# Altium schematic sheet tl494_ctrl.SchDoc
size A4; SheetNumber: 11; SheetTotal: 14
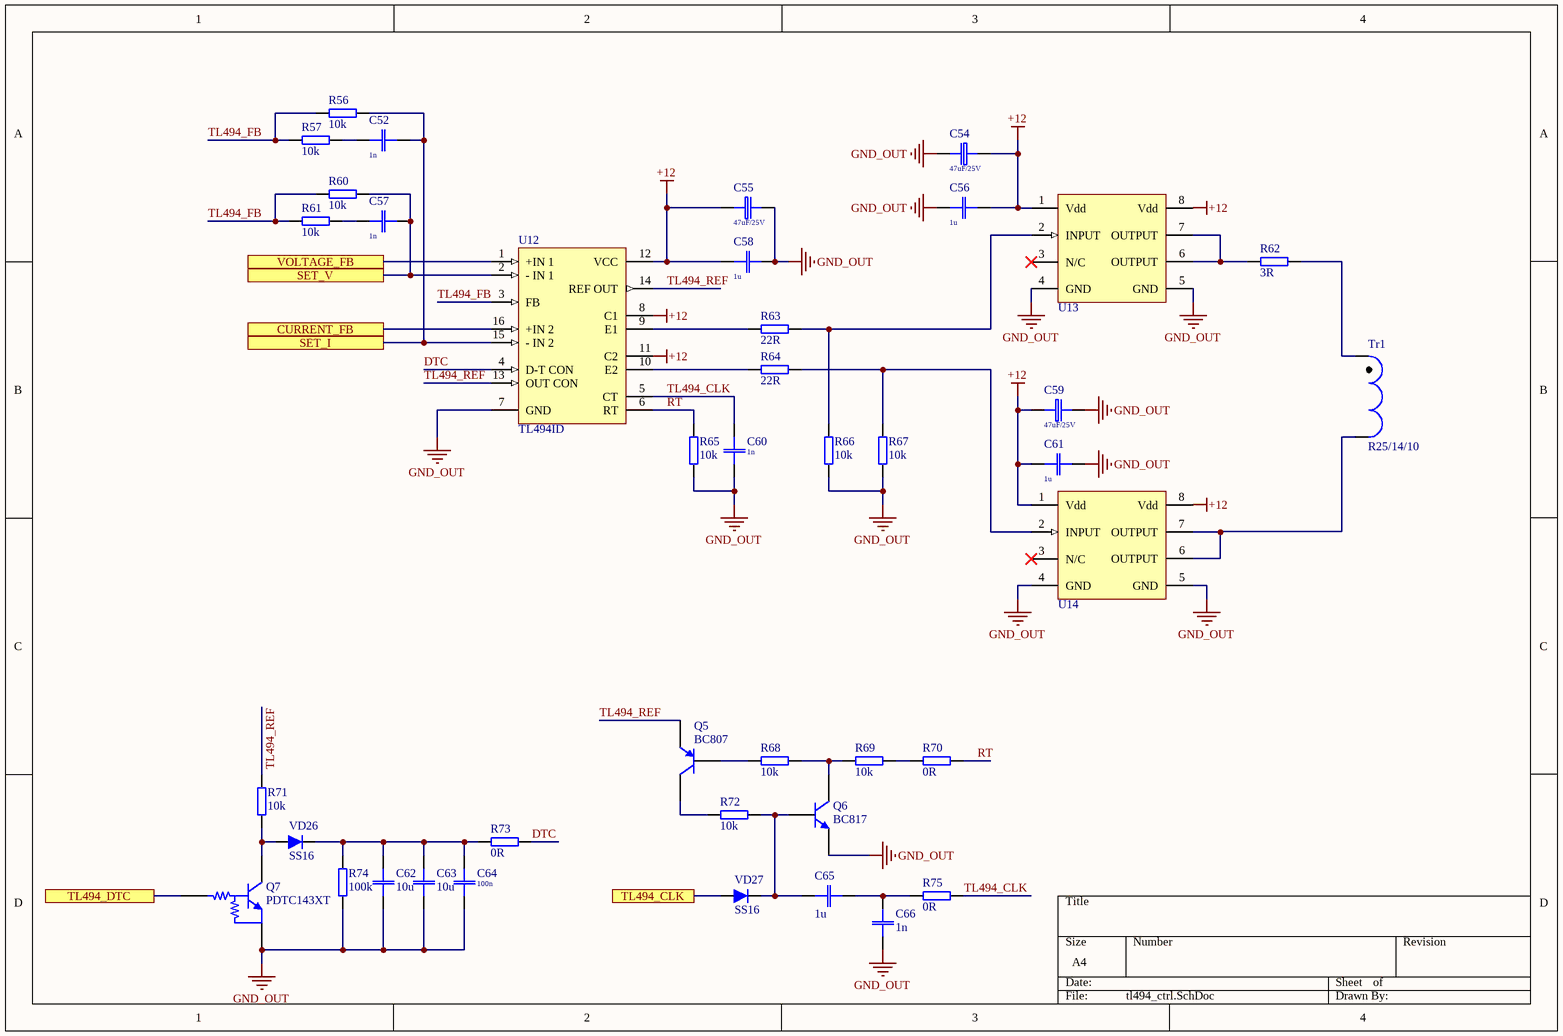
[diagram p0: tl494_ctrl.SchDoc]

## Parts
C52  1n  [C0603]
C54  47uF/25V  [EL Case C (6032-28)]
C55  47uF/25V  [EL Case C (6032-28)]
C56  1u  [C1206(3216)]
C57  1n  [C0603]
C58  1u  [C1206(3216)]
C59  47uF/25V  [EL Case C (6032-28)]
C60  1n  [C0603]
C61  1u  [C1206(3216)]
C62  10u  [CAP: 0805]
C63  10u  [CAP: 0805]
C64  100n  [C0603]
C65  1u  [CAP: 0805]
C66  1n  [CAP: 0805]
Q5  BC807  [SOT23_N]
Q6  BC817  [SOT23_N]
Q7  PDTC143XT  [SOT23_N]
R56  10k  [RES: 0603]
R57  10k  [RES: 0603]
R60  10k  [RES: 0603]
R61  10k  [RES: 0603]
R62  3R  [RES: 1206]
R63  22R  [RES: 0603]
R64  22R  [RES: 0603]
R65  10k  [RES: 0603]
R66  10k  [RES: 0603]
R67  10k  [RES: 0603]
R68  10k  [RES: 0603]
R69  10k  [RES: 0603]
R70  0R  [RES: 0603]
R71  10k  [RES: 0603]
R72  10k  [RES: 0603]
R73  0R  [RES: 0603]
R74  100k  [RES: 0603]
R75  0R  [RES: 0603]
Tr1  R25/14/10  [IND: PRIMARY_SIDE_HB_B]
U12  TL494ID  [D016_N]
U13  TC4420  [8-SOIC]  (value not drawn)
U14  TC4420  [8-SOIC]  (value not drawn)
VD26  SS16  [DIODE: SOD123]
VD27  SS16  [DIODE: SOD123]

## Ports
CURRENT_FB, SET_I, SET_V, TL494_CLK, TL494_DTC, VOLTAGE_FB

## Nets
+12: C54.1(+) C55.1(+) C56.1 C58.1 C59.1(+) C61.1 U12.8(C1) U12.11(C2) U12.12(VCC) U13.1(Vdd) U13.8(Vdd) U14.1(Vdd) U14.8(Vdd)
GND_OUT: C54.2(-) C55.2(-) C56.2 C58.2 C59.2(-) C60.1 C61.2 C62.1 C63.1 C64.1 C66.2 Q6.2(E) Q7.2(E) R65.2 R66.2 R67.2 R74.1 U12.7(GND) U13.4(GND) U13.5(GND) U14.4(GND) U14.5(GND)
CURRENT_FB: U12.16(+IN_2) ; port CURRENT_FB
DTC: R73.1 U12.4(D-T_CON)
RT: R65.1 R70.2 U12.6(RT)
SET_I: C52.1 R56.2 U12.15(-_IN_2) ; port SET_I
SET_V: C57.1 R60.2 U12.2(-_IN_1) ; port SET_V
TL494_CLK: C60.2 R75.2 U12.5(CT)
TL494_CLK: VD27.1(A) ; port TL494_CLK  [a separate net that carries the same name]
TL494_DTC: Q7.1(B) ; port TL494_DTC
TL494_FB: R56.1 R57.1 R60.1 R61.1 U12.3(FB)
TL494_REF: Q5.2(E) R71.1 U12.13(OUT_CON) U12.14(REF_OUT)
VOLTAGE_FB: U12.1(+IN_1) ; port VOLTAGE_FB
NetC52_2: C52.2 R57.2
NetC57_2: C57.2 R61.2
NetC62_2: C62.2 C63.2 C64.2 R73.2 R74.2 VD26.2(C)
NetC65_1: C65.1 C66.1 R75.1
NetC65_2: C65.2 Q6.1(B) R72.2 VD27.2(C)
NetQ5_1: Q5.1(B) R68.1
NetQ5_3: Q5.3(C) R72.1
NetQ6_3: Q6.3(C) R68.2 R69.1
NetQ7_3: Q7.3(C) R71.2 VD26.1(A)
NetR62_1: R62.1 U13.6(OUTPUT) U13.7(OUTPUT)
NetR62_2: R62.2 Tr1.1
NetR63_1: R63.1 U12.9(E1)
NetR63_2: R63.2 R66.1 U13.2(INPUT)
NetR64_1: R64.1 U12.10(E2)
NetR64_2: R64.2 R67.1 U14.2(INPUT)
NetR69_2: R69.2 R70.1
NetTr1_2: Tr1.2 U14.6(OUTPUT) U14.7(OUTPUT)

Not connected (* = marked no-connect by the designer): U13 3(N/C)*; U14 3(N/C)*

## Library data of the parts
C52 C57 C60 C64 = C-0603: SMD-0603; Price: 0.014
  C52 C57 C60: Value: 1n
  C64: Value: 100n
C54 C55 C59 = EL Case C (6032-28): EL Tantalum Case C (6032-28); Price: 0.41; Value: 47uF/25V
C56 C58 C61 = C-1206  100V 1u: SMD-1206 100V X7R 10%; Price: 0.085; Value: 1u
C62 C63 C65 C66 = C_SMD
  C62 C63: Value: 10u
  C65: Value: 1u
  C66: Value: 1n
Q5 = BC807: PNP General-purpose Transistor; Published: 17-Sep-2003; LatestRevisionDate: 12-Dec-2006; LatestRevisionNote: IPC-7351 Footprint Added.; DatasheetVersion: 8-Apr-1999; PackageVersion: May-1999; PackageReference: SOT23; Publisher: Altium Limited; PackageDescription: 3-Pin SOT-23 Package 0.95 mm Pitch, 2.3 mm Lead Span; ComponentLink1Description: Manufacturer Link; ComponentLink1URL: http://www.semiconductors.philips.com/; ComponentLink2Description: Datasheet; ComponentLink2URL: http://www.semiconductors.philips.com/acrobat/datasheets/BC807_BC807W_BC327_5.pdf
Q6 = BC817: NPN General-purpose Transistor; Published: 17-Sep-2003; LatestRevisionDate: 12-Dec-2006; LatestRevisionNote: IPC-7351 Footprint Added.; DatasheetVersion: Jun-1999; PackageVersion: May-1999; PackageReference: SOT23; Publisher: Altium Limited; PackageDescription: 3-Pin SOT-23 Package 0.95 mm Pitch, 2.3 mm Lead Span; ComponentLink1Description: Manufacturer Link; ComponentLink1URL: http://www.semiconductors.philips.com/; ComponentLink2Description: Datasheet; ComponentLink2URL: http://www.semiconductors.philips.com/acrobat/datasheets/BC817_BC817W_BC337_5.pdf
Q7 = PDTC143XT: NPN Resistor-equipped Transistor; Published: 17-Sep-2003; LatestRevisionDate: 12-Dec-2006; LatestRevisionNote: IPC-7351 Footprint Added.; DatasheetVersion: 20-Apr-1999; PackageVersion: May-1999; PackageReference: SOT23; Publisher: Altium Limited; PackageDescription: 3-Pin SOT-23 Package 0.95 mm Pitch, 2.3 mm Lead Span; ComponentLink1Description: Manufacturer Link; ComponentLink1URL: http://www.semiconductors.philips.com/; ComponentLink2Description: Datasheet; ComponentLink2URL: http://www.semiconductors.philips.com/acrobat/datasheets/PDTC143X_SERIES_8.pdf
R56 R57 R60-R75 = R_SMD
  R56 R57 R60 R61 R65-R69 R71 R72: Value: 10k
  R62: Value: 3R
  R63 R64: Value: 22R
  R70 R73 R75: Value: 0R
  R74: Value: 100k
Tr1 = Primary: Value: R25/14/10
U12 = TL494ID: Pulse-Width-Modulation Control Circuit; Published: 15-Apr-2002; LatestRevisionDate: 13-Apr-2006; LatestRevisionNote: IPC-7351 Footprint Added.; DatasheetVersion: Oct-1988; PackageVersion: Jan-1998; PackageReference: D016; Publisher: Altium Limited; PackageDescription: 16-Pin Small Outline Integrated Circuit 1.27 mm Pitch; Code_IPC: SOIC127P600-16; ComponentLink1Description: Manufacturer Link; ComponentLink1URL: http://www.ti.com/
VD26 VD27 = DIODE_SMD: Value: SS16